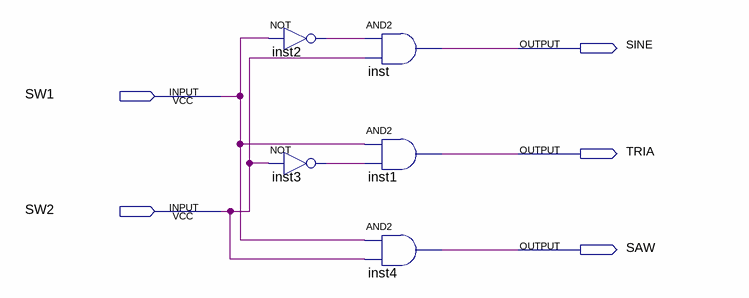
[diagram p0: schematic sheet]
// Quartus schematic DacShapeBD.bdf as structural Verilog: 5 symbols, 5 pins
module DacShapeBD (
  input  SW1,
  input  SW2,
  output SINE,
  output TRIA,
  output SAW
);

  wire inst2_out, inst3_out;

  not inst2 (inst2_out, SW1);
  not inst3 (inst3_out, SW2);
  and inst (SINE, inst2_out, SW2);
  and inst1 (TRIA, SW1, inst3_out);
  and inst4 (SAW, SW1, SW2);
endmodule
